# EAGLE design giraffe12 (EAGLE 8.4.1)
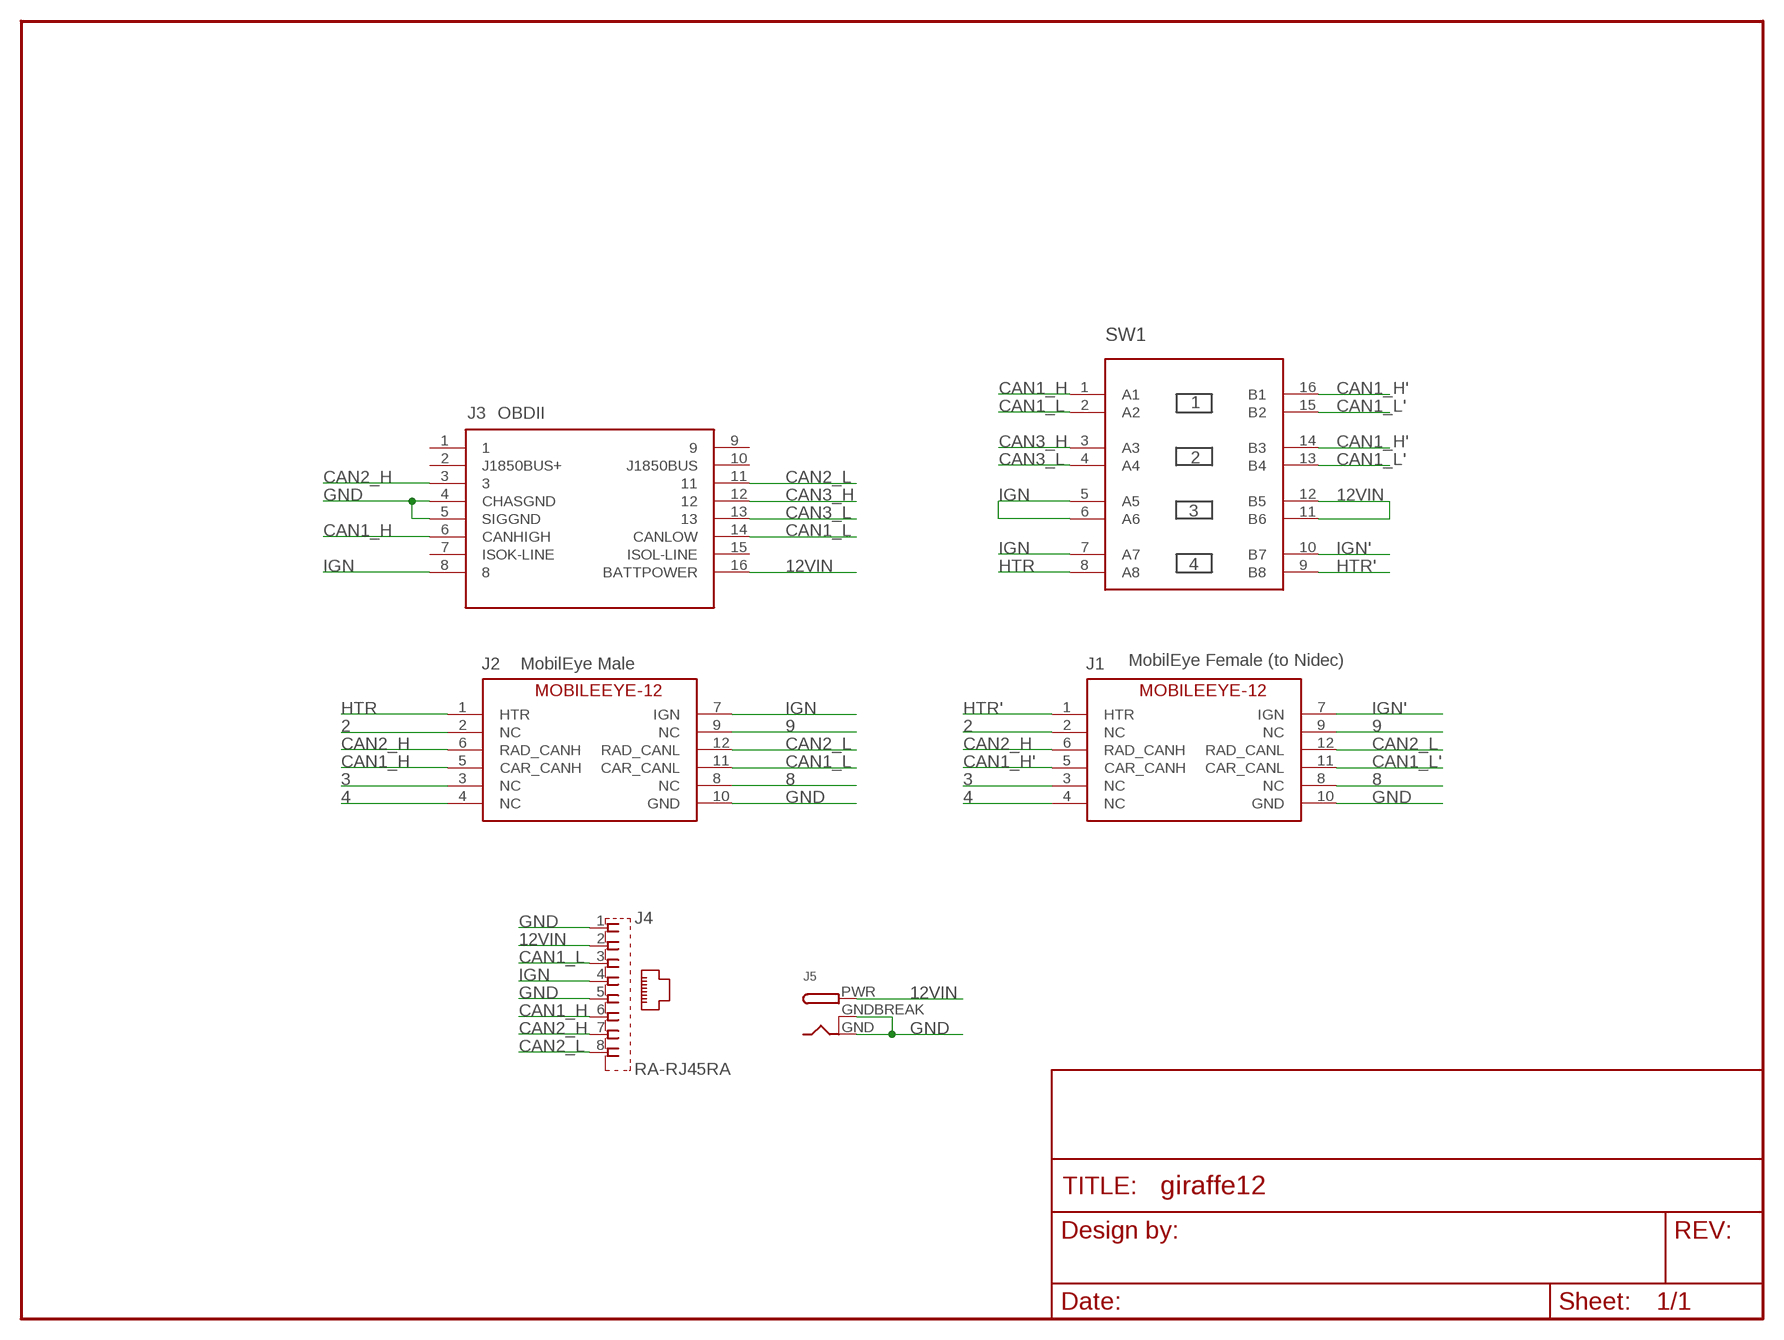
[diagram p0: schematic, sheet 1]

## Parts
FRAME1  FRAME-LETTERNO_PACKAGE  [DUMMY]
J1  MOBILEEYE-12FEMALE  [2X6-TE-FEMALE]
J2  MOBILEEYE-12MALE  [2X6-TE-RA]
J3  OBDII-FEMALE-CUT  [OBDII-FEMALE-MIDCUT]
J4  RA-RJ45RA  [RA-RJ45]
J5  DCBARRELPTH  [DCJACK_2MM_PTH]
SW1  4XDPSTSMT  [4-DPST]

## Nets
2: J1.2(NC) J2.2(NC)
3: J1.3(NC) J2.3(NC)
4: J1.4(NC) J2.4(NC)
8: J1.8(NC) J2.8(NC)
9: J1.9(NC) J2.9(NC)
12VIN: J3.16(BATTPOWER) J4.2 J5.PWR SW1.11(B6) SW1.12(B5)
CAN1_H: J2.5(CAR_CANH) J3.6(CANHIGH) J4.6 SW1.1(A1)
CAN1_H': J1.5(CAR_CANH) SW1.14(B3) SW1.16(B1)
CAN1_L: J2.11(CAR_CANL) J3.14(CANLOW) J4.3 SW1.2(A2)
CAN1_L': J1.11(CAR_CANL) SW1.13(B4) SW1.15(B2)
CAN2_H: J1.6(RAD_CANH) J2.6(RAD_CANH) J3.3 J4.7
CAN2_L: J1.12(RAD_CANL) J2.12(RAD_CANL) J3.11 J4.8
CAN3_H: J3.12 SW1.3(A3)
CAN3_L: J3.13 SW1.4(A4)
GND: J1.10(GND) J2.10(GND) J3.4(CHASGND) J3.5(SIGGND) J4.1 J4.5 J5.GND J5.GNDBREAK
HTR: J2.1(HTR) SW1.8(A8)
HTR': J1.1(HTR) SW1.9(B8)
IGN: J2.7(IGN) J3.8 J4.4 SW1.5(A5) SW1.6(A6) SW1.7(A7)
IGN': J1.7(IGN) SW1.10(B7)
Unconnected: J3.1 J3.2(J1850BUS+) J3.7(ISOK-LINE) J3.9 J3.10(J1850BUS) J3.15(ISOL-LINE)

## Notes on the sheet
- OBDII
- MobilEye Male | MobilEye Female (to Nidec)

## Library data of the parts
FRAME1 = SparkFun-Aesthetics:FRAME-LETTER: Schematic Frame Standard 8.5x11 US Letter frame; DESIGNER: Nobody; VERSION: v01
J1 J2 = comma.ai:MOBILEEYE-12
J3 = comma.ai:OBDII-FEMALE
J4 = comma.ai:RA-RJ45
J5 = adafruit:DCBARREL: 2.0mm DC Barrel Jack DCJACK_2MM_PTH - Through Hole Jack (4UConnector: 05537)
SW1 = comma.ai:4XDPST

## Board
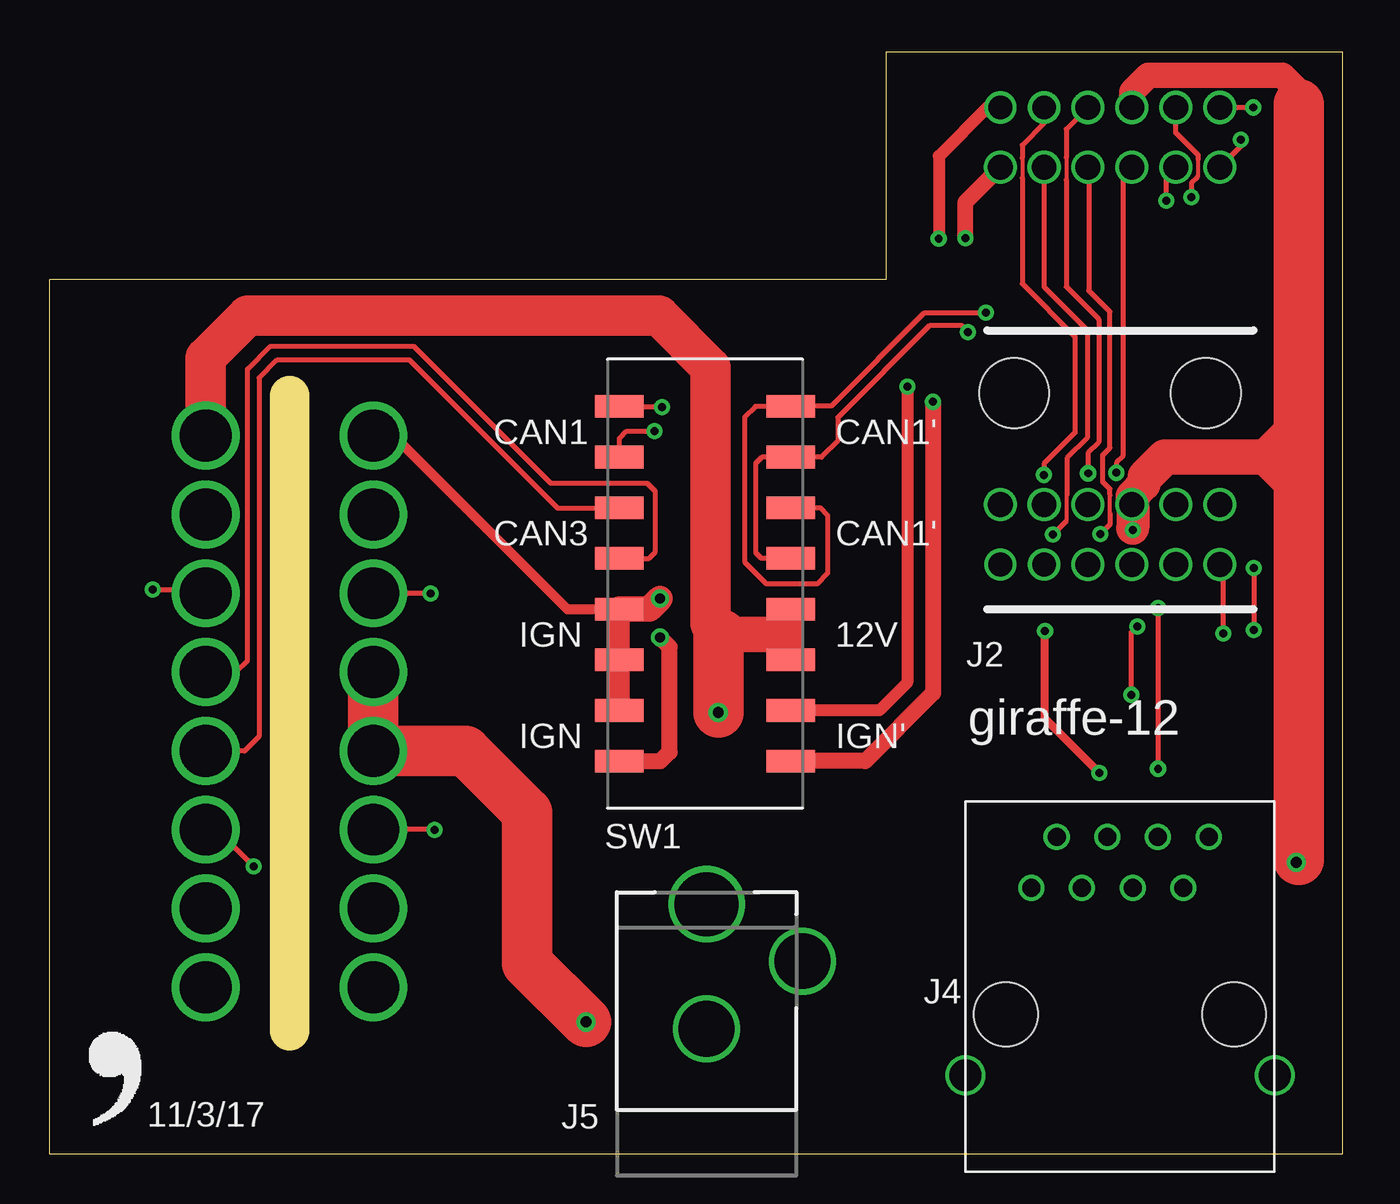
[diagram p1: board, top side]
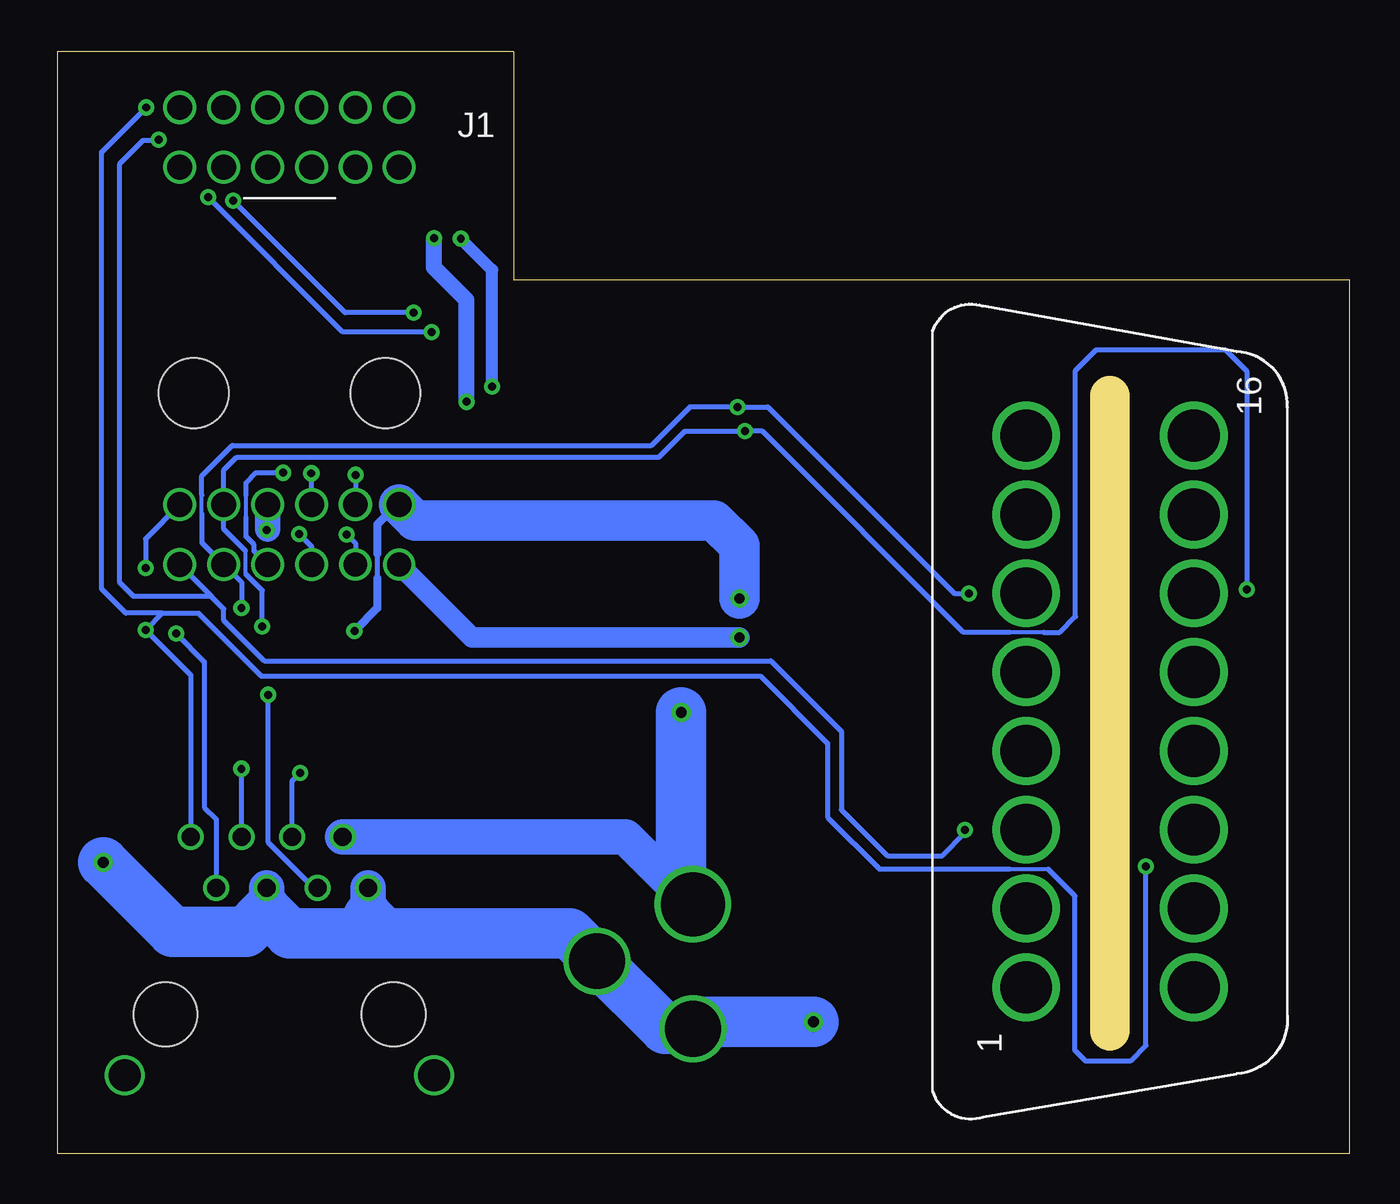
[diagram p2: board, bottom side, seen from below]

Size 64.77 x 55.24 mm. Coordinates in mm from the lower left corner, seen from the top.
Outline: 12.01,6.17 12.01,38
Outline: 41.91,55.24 64.77,55.24 64.77,0 0,0 0,43.81 41.91,43.81 41.91,55.24
Copper layers (1*16): Top 0.035mm / dielectric 1.5mm / Bottom 0.035mm
Design rules "default *": minimum track width 6mil, minimum drill 10mil, track to track 6mil, track to pad 6mil, pad to pad 6mil, via to via 6mil, smd to smd 6mil, copper to edge 15mil, drill to drill 10mil, minimum pad ring 8mil, minimum via ring 8mil, stop-mask expansion 4mil, vias tented up to drill 0mil, thermal gap 10mil

### Footprints (pad centres in the part's own frame; a part is rotated, then mirrored left to right if it is on the bottom)
2X6-TE-FEMALE = drill 1.25: 1 -5.5,1.5; 2 -3.3,1.5; 3 -1.1,1.5; 4 1.1,1.5; 5 3.3,1.5; 6 5.5,1.5; 9 -1.1,-1.5; 10 1.1,-1.5; 11 3.3,-1.5; 12 5.5,-1.5 | drill 1.2: 7 -5.5,-1.5; 8 -3.3,-1.5
2X6-TE-RA = drill 1.2: 1 -5.5,-1.5; 2 -3.3,-1.5 | drill 1.25: 3 -1.1,-1.5; 4 1.1,-1.5; 5 3.3,-1.5; 6 5.5,-1.5; 7 -5.5,1.5; 8 -3.3,1.5; 9 -1.1,1.5; 10 1.1,1.5; 11 3.3,1.5; 12 5.5,1.5 | hole 3.5: -4.8,7.1; 4.8,7.1
OBDII-FEMALE-MIDCUT = drill 2.6 pad 3.4: 1 13.825,-4.2; 2 9.875,-4.2; 3 5.925,-4.2; 4 1.975,-4.2; 5 -1.975,-4.2; 6 -5.925,-4.2; 7 -9.875,-4.2; 8 -13.825,-4.2; 9 13.825,4.2; 10 9.875,4.2; 11 5.925,4.2; 12 1.975,4.2; 13 -1.975,4.2; 14 -5.925,4.2; 15 -9.875,4.2; 16 -13.825,4.2
RA-RJ45 = drill 0.9: 1 -4.445,6.35; 2 -3.175,8.89; 3 -1.905,6.35; 4 -0.635,8.89; 5 0.635,6.35; 6 1.905,8.89; 7 3.175,6.35; 8 4.445,8.89 | drill 1.6: P$1 -7.75,-3.05; P$2 7.75,-3.05 | hole 3.2: -5.715,0; 5.715,0
DCJACK_2MM_PTH = drill 2.8: GND 0,7.35; GNDBREAK 4.8,10.75 | drill 3.2: PWR 0,13.6
4-DPST = smd 1.13 x 2.44: 1 -8.89,-4.3; 2 -6.35,-4.3; 3 -3.81,-4.3; 4 -1.27,-4.3; 5 1.27,-4.3; 6 3.81,-4.3; 7 6.35,-4.3; 8 8.89,-4.3; 9 8.89,4.3; 10 6.35,4.3; 11 3.81,4.3; 12 1.27,4.3; 13 -1.27,4.3; 14 -3.81,4.3; 15 -6.35,4.3; 16 -8.89,4.3

### Placement (x,y rotation side)
FRAME1  -8.89,-10.79 0 top  (outside the outline)
J1  53.14,50.95 180 bottom
J2  53.14,31.04 0 top
J3  12.01,22.17 270 bottom
J4  53.64,6.99 0 top
J5  32.92,-1.09 0 top
SW1  32.84,28.57 270 top
U$1  [LOGO]  1.3,1.12 0 top

### Tracks (layer width: path | path; a pad name or v marks a point on that pad's centre or on a via)
2  (via drill 0.4)
  Top 0.203: 50.98,33.05 50.98,33.01 50.95,32.99 50.95,31.73
  Top 0.254: J1.2 49.84,43.46 51.99,41.3 51.99,35.89 50.98,34.87 50.98,33.05 | 50.95,31.73 v50.27,31.04
  Bottom 0.254: v50.27,31.04 49.84,30.61 J2.2
3  (via drill 0.4)
  Top 0.203: 53.14,32.07 53.14,33.02 53.14,33.12
  Top 0.254: J1.3 52.07,49.42 52.07,43.28 53.14,42.22 53.14,35.38 52.78,35.03 52.78,33.68 53.14,33.33 53.14,33.02 | 53.14,32.07 53.14,31.55 v52.65,31.06
  Bottom 0.254: v52.65,31.06 52.04,30.45 J2.3
4  (via drill 0.4)
  Top 0.254: J1.4 53.77,48.99 53.77,34.95 53.47,34.65 v53.47,34.14
  Bottom 0.203: 55.32,31.9 55.32,33.02
  Bottom 0.254: J2.4 54.91,30.22 54.91,30.53 55.32,30.94 55.32,31.9 | 55.32,33.02 55.32,33.63 54.81,34.14 v53.47,34.14
8  (via drill 0.4)
  Top 0.203: 48.74,49.92 48.74,48.92
  Top 0.254: J1.8 49.84,51.67 48.74,50.57 48.74,49.92 | 48.74,48.92 48.74,43.61 51.38,40.97 51.38,36.14 49.84,34.59 v49.84,34.04
  Bottom 0.254: v49.84,34.04 v49.84,34.03 J2.8
9  (via drill 0.4)
  Top 0.203: 50.95,49.93 50.95,48.82
  Top 0.254: J1.9 50.95,51.37 50.95,49.93 | 50.95,48.82 50.95,43.46 52.58,41.83 52.58,35.66 52.04,35.12 v52.04,34.12 v52.05,34.11
  Bottom 0.254: v52.05,34.11 J2.9
12VIN  (via drill 0.55)
  Top 0.61: 35.51,26.04 36.78,27.3 SW1.12
  Top 1.016: SW1.12 SW1.11
  Top 1.778: 36.5,26.11 36.42,26.04 35.51,26.04 33.67,26.04
  Top 2.032: J3.16 7.81,39.92 9.91,42.01 30.53,42.01 33.12,39.42 33.12,26.58 33.67,26.04
  Top 2.54: v33.5,22.12 33.5,25.87 33.67,26.04
  Bottom 1.778: J5.PWR 36.29,15.88 J4.2
  Bottom 2.54: v33.5,22.12 33.5,13.09 J5.PWR
CAN1_H  (via drill 0.4)
  Top 0.254: 28.55,37.46 SW1.1 30.66,37.47 v30.68,37.44 | v19.07,28.09 J3.6 | v55.55,27.36 v55.55,19.3
  Bottom 0.203: 57.53,32.08 57.53,33.01
  Bottom 0.254: v55.55,27.36 55.55,28.65 J2.5 57.53,30.63 57.53,32.08 | v19.07,28.09 19.81,28.09 29.16,37.44 v30.68,37.44 33.07,37.44 35,35.51 56.01,35.51 57.53,33.98 57.53,33.01 | J4.6 v55.55,19.3
CAN1_H'  (via drill 0.4)
  Top 0.254: SW1.14 38.61,32.38 38.99,32 38.99,29.11 38.46,28.57 35.92,28.57 34.85,29.64 34.85,36.96 35.36,37.47 SW1.16 37.17,37.49 39.17,37.49 43.84,42.16 v46.91,42.16 | v55.96,47.78 55.96,48.97 J1.5
  Bottom 0.254: v46.91,42.16 50.34,42.16 v55.96,47.78
CAN1_L  (via drill 0.4)
  Top 0.254: v5.16,28.3 7.62,28.3 J3.14 | 29.01,34.92 SW1.2 28.54,35.86 28.91,36.22 v30.3,36.22 | v54.2,23.01 54.2,26.14 v54.51,26.44
  Bottom 0.203: 15.34,26.14 17.05,26.14 | 55.34,29.07 55.34,30.22 55.35,30.23
  Bottom 0.254: J2.11 | 15.34,26.14 14.53,26.14 13.74,26.92 13.74,39.27 12.7,40.31 6.22,40.31 5.16,39.24 v5.16,28.3 | 17.05,26.14 19.36,26.14 29.44,36.22 v30.3,36.22 33.33,36.22 34.62,34.92 55.78,34.92 56.44,34.27 J2.11 | J4.3 51.92,13.34 54.2,15.62 v54.2,23.01 | v54.51,26.44 54.51,28.24 55.34,29.07 | 55.35,30.23 56.44,31.32 J2.11
CAN1_L'  (via drill 0.4)
  Top 0.203: 57.54,48.99 57.55,49 57.55,49.84
  Top 0.254: SW1.15 37.92,34.92 | SW1.13 35.66,29.84 35.38,30.12 35.38,34.62 35.69,34.92 SW1.15 | SW1.15 | v57.23,47.95 57.23,48.67 57.54,48.99 | 57.55,49.84 57.56,49.84 57.56,50.06 56.44,51.18 J1.11 | SW1.15 | SW1.15 38.68,34.92 39.5,35.74 39.5,36.91 44.12,41.53 45.7,41.53 v46.02,41.2
  Bottom 0.254: v46.02,41.2 50.47,41.2 v57.23,47.95
CAN2_H  (via drill 0.4)
  Top 0.254: v19.28,16.23 19.26,16.25 J3.3 | v58.83,26.09 58.83,29.35 J2.6 | v59.69,50.83 59.69,50.51 J1.6
  Bottom 0.254: 57.06,27.94 56.44,27.32 56.44,26.74 54.41,24.71 29.01,24.71 25.48,21.18 25.48,17.25 23.16,14.94 20.42,14.94 19.28,16.08 v19.28,16.23 | 57.06,27.94 60.96,27.94 61.65,28.63 61.65,49.63 60.48,50.8 59.72,50.8 v59.69,50.83 | J2.6 57.06,27.96 57.06,27.94 | v58.83,26.09 57.4,24.66 57.4,17.37 56.81,16.79 J4.7
CAN2_L  (via drill 0.4)
  Top 0.254: v60.35,29.36 v60.35,26.26 | v10.21,14.4 8.36,16.25 J3.11 | v60.33,52.45 J1.12
  Bottom 0.203: 17.04,14.28 15.11,14.28
  Bottom 0.254: 59.51,27.1 61.34,27.1 62.56,28.32 62.56,50.22 v60.33,52.45 | 59.51,27.1 57.71,27.1 54.56,23.95 29.54,23.95 26.16,20.57 26.16,16.87 23.57,14.28 17.04,14.28 | J1.12 | J2.12 60.35,30.82 v60.35,29.36 | 59.51,27.1 v60.35,26.26 58.09,24 J4.8 | 15.11,14.28 13.77,12.93 13.77,5.18 13.23,4.65 11,4.65 10.21,5.44 v10.21,14.4
CAN3_H
  Top 0.254: J3.12 9.75,20.19 10.49,20.93 10.49,38.89 11.4,39.8 18.01,39.8 25.45,32.36 28.12,32.36 28.14,32.38 | 28.14,32.38 SW1.3 | 28.14,32.38 27.86,32.38
CAN3_L
  Top 0.254: SW1.4 30.02,29.84 30.35,30.18 30.35,33.2 29.95,33.6 25.12,33.6 18.26,40.46 11.02,40.46 9.91,39.34 9.91,24.71 9.35,24.16 J3.13
GND  (via drill 0.4, 0.55)
  Top 0.508: 54.23,52.46 J1.10
  Top 1.27: 54.23,52.46 54.23,53.24 55.06,54.07 61.78,54.07 62.61,53.24 62.61,52.6
  Top 1.524: 62.61,32.38 62.47,32.38
  Top 1.651: 54.91,33.96 54.85,33.89 54.85,33.57 54.24,32.96 54.24,32.56 J2.10 54.28,32.5 54.28,31.34
  Top 1.778: 62.61,34.92 60.96,34.92 | 60.96,34.92 55.88,34.92 54.91,33.96 | 60.96,34.92 62.61,36.58 62.61,37.47 | 60.96,34.92 62.61,33.27 62.61,32.38
  Top 2.032: 16.21,22.21 J3.4 | v62.48,14.61 62.61,14.73
  Top 2.54: 62.61,14.73 62.61,32.38 62.61,34.92 62.61,37.47 62.61,52.6 | J3.5 J3.4 20.85,20.2 23.93,17.12 23.93,9.55 v26.87,6.6
  Bottom 1.016: v54.28,31.27 54.24,31.31
  Bottom 1.27: 54.24,31.31 J2.10
  Bottom 1.778: 49.2,11.89 J4.1 | 55.35,11.12 54.27,12.2 J4.5
  Bottom 2.54: v62.48,14.61 59,11.12 55.35,11.12 54.28,12.19 53.14,11.05 48.36,11.05 | v26.87,6.6 32.57,6.6 J5.GND 34.32,6.26 J5.GNDBREAK 39.11,11.05 48.36,11.05 | 48.36,11.05 49.2,11.89
HTR  (via drill 0.5)
  Top 0.813: SW1.8 30.61,19.68 31.06,20.14 31.06,25.4 v30.58,25.88
  Bottom 0.61: J2.1 47.61,29.57
  Bottom 1.016: v30.58,25.88 43.98,25.88 J2.1
HTR'  (via drill 0.4)
  Top 0.61: 44.27,25.83
  Top 0.813: v45.9,45.9 45.9,47.71 J1.1 | v44.27,37.7 44.27,25.83 | 44.27,25.83 44.27,23.09 40.87,19.68 SW1.9
  Bottom 0.61: v45.9,45.9 v45.9,45.89
  Bottom 0.813: v44.27,37.7 44.27,42.8 45.9,44.42 v45.9,45.89
IGN  (via drill 0.4, 0.5)
  Top 0.406: v49.89,26.21 49.89,21.82 v52.6,19.1
  Top 0.508: 16.23,36.02 J3.8 17.24,36 25.93,27.3 SW1.5
  Top 0.61: SW1.7 28.52,22.25
  Top 1.016: SW1.7 SW1.6 SW1.5
  Top 1.27: SW1.5 30.05,27.3 v30.58,27.84
  Bottom 0.254: 48.74,30.08 48.74,28.85 | J4.4 53.01,18.7 v52.6,19.1
  Bottom 0.406: J2.7 47.75,32.54 48.74,31.55 48.74,30.08 | 48.74,28.85 48.74,27.36 v49.89,26.21
  Bottom 0.61: 47.59,32.49 J2.7
  Bottom 2.032: J2.7 46.85,31.75 35.56,31.75 33.66,31.75 | 33.66,31.75 33.02,31.75 | 33.66,31.75 31.85,31.75 30.58,30.48 v30.58,27.84
IGN'  (via drill 0.4)
  Top 0.61: J1.7 46.99,52.45 44.55,50.01 v44.55,45.87 | SW1.10 41.58,22.23 42.98,23.62 v42.98,38.46
  Bottom 0.61: v44.55,45.87 42.98,44.3 v42.98,38.46

### Text on the board
tPlace: CAN1 | CAN1' | CAN3 | CAN1' | IGN | 12V | giraffe-12 | IGN | IGN' | 11/3/17